# Altium schematic sheet 03-MCU.SchDoc: MCU
size A2; DocumentNumber: 3; SheetNumber: 3; SheetTotal: 15
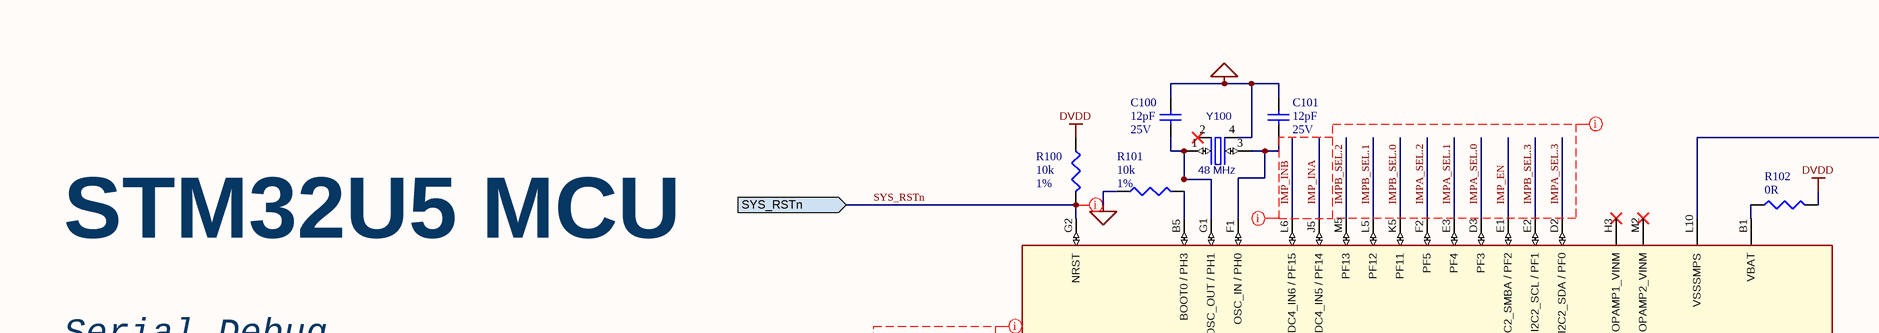
[diagram p0: 03-MCU.SchDoc, top left]
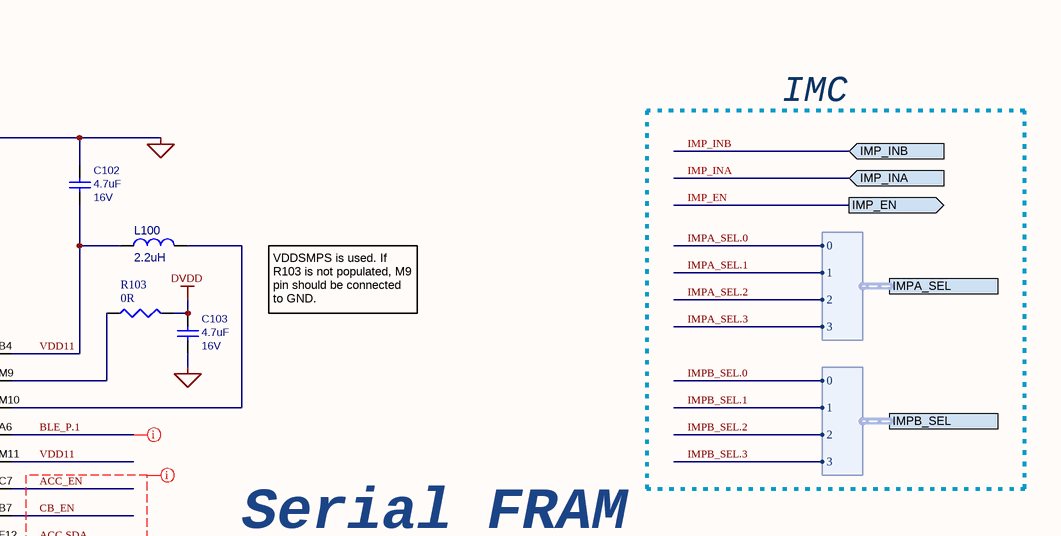
[diagram p1: 03-MCU.SchDoc, top right]
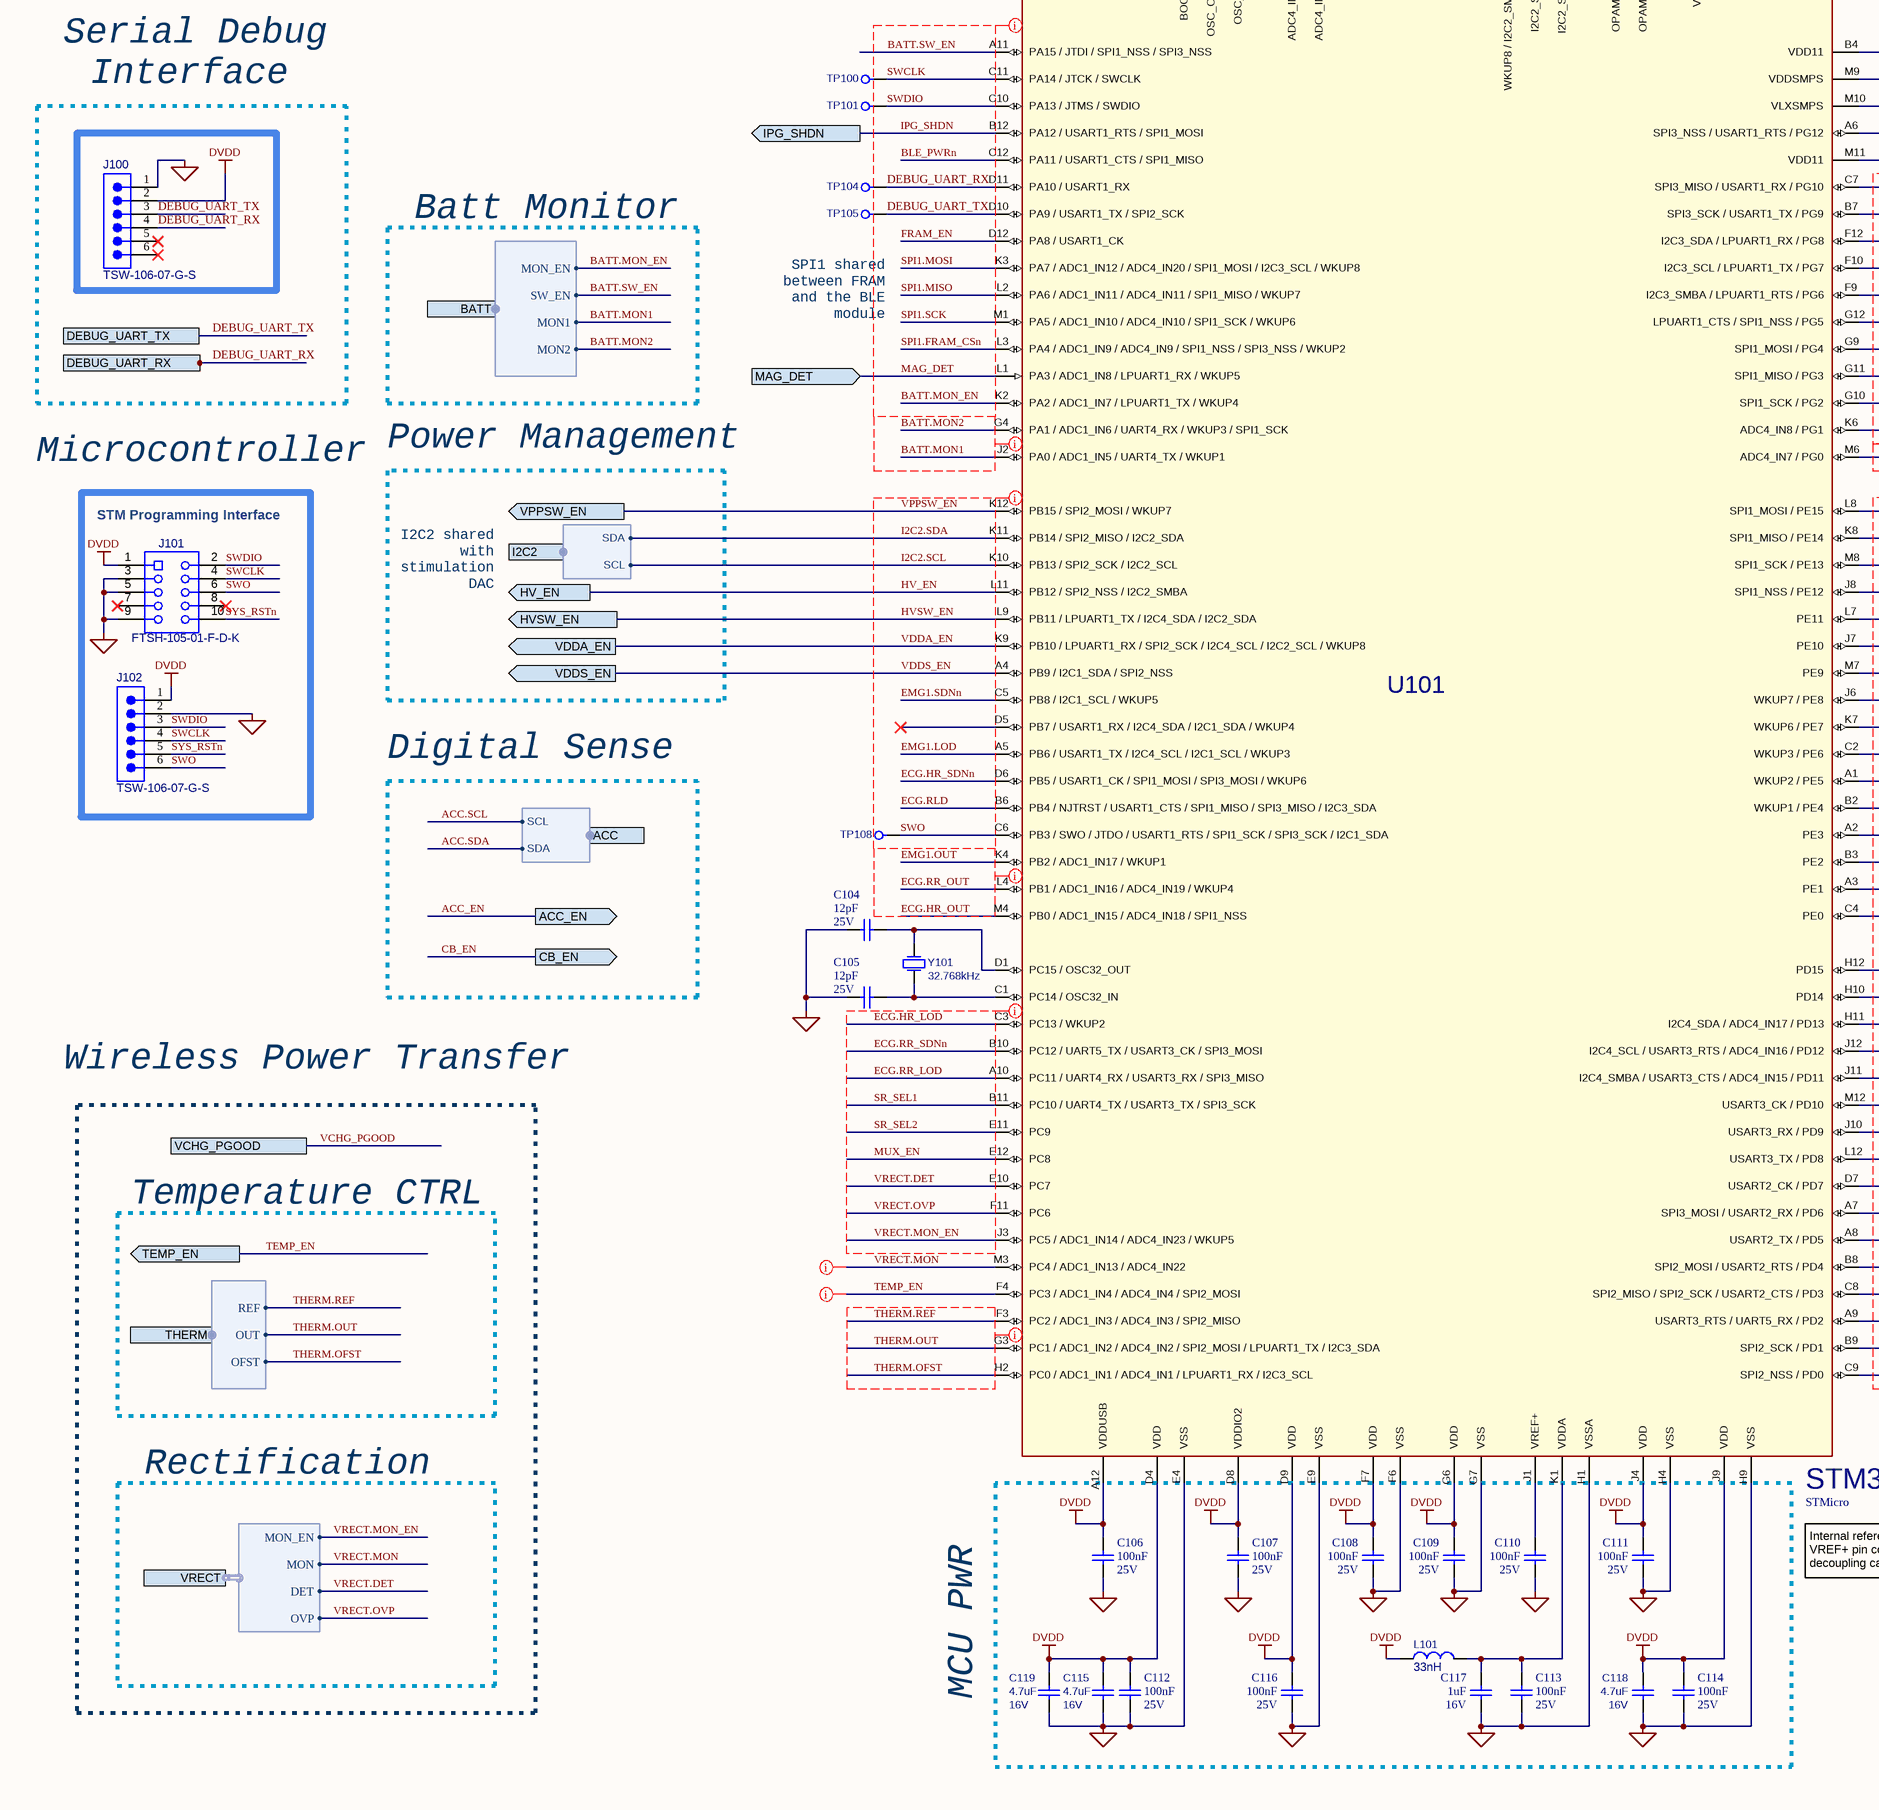
[diagram p2: 03-MCU.SchDoc, bottom left]
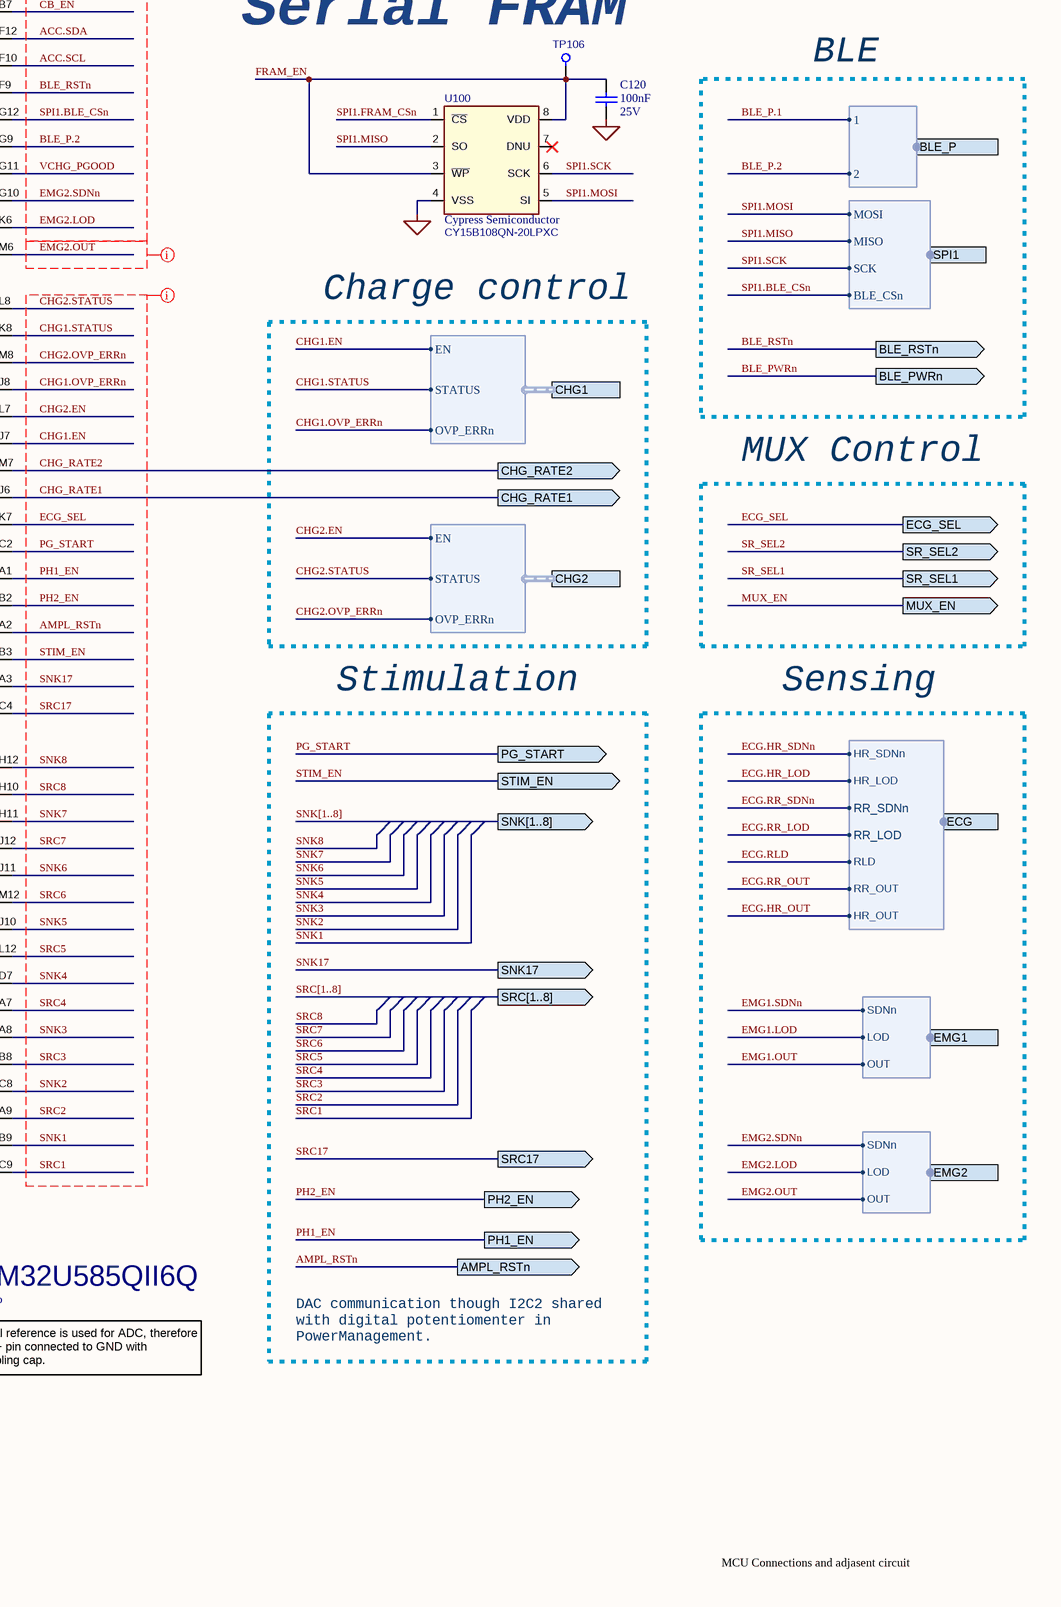
[diagram p3: 03-MCU.SchDoc, bottom right]

## Parts
C100  value 12pF  Rated DC Voltage (URdc): 25V  [C0201_C]  (hidden comment: GRM0335C1E120JA01D)
C101  value 12pF  Rated DC Voltage (URdc): 25V  [C0201_C]  (hidden comment: GRM0335C1E120JA01D)
C102  value 4.7uF  Rating: 16V  [CAP0603_REDUCED]  (hidden comment: GRM188R61C475KE11)
C103  value 4.7uF  Rating: 16V  [CAP0603_REDUCED]  (hidden comment: GRM188R61C475KE11)
C104  value 12pF  Rated DC Voltage (URdc): 25V  [C0201_C]  (hidden comment: GRM0335C1E120JA01D)
C105  value 12pF  Rated DC Voltage (URdc): 25V  [C0201_C]  (hidden comment: GRM0335C1E120JA01D)
C106  value 100nF  Rated DC Voltage (URdc): 25V  [C0201_C]  (hidden comment: GRM033R61E104KE14J)
C107  value 100nF  Rated DC Voltage (URdc): 25V  [C0201_C]  (hidden comment: GRM033R61E104KE14J)
C108  value 100nF  Rated DC Voltage (URdc): 25V  [C0201_C]  (hidden comment: GRM033R61E104KE14J)
C109  value 100nF  Rated DC Voltage (URdc): 25V  [C0201_C]  (hidden comment: GRM033R61E104KE14J)
C110  value 100nF  Rated DC Voltage (URdc): 25V  [C0201_C]  (hidden comment: GRM033R61E104KE14J)
C111  value 100nF  Rated DC Voltage (URdc): 25V  [C0201_C]  (hidden comment: GRM033R61E104KE14J)
C112  value 100nF  Rated DC Voltage (URdc): 25V  [C0201_C]  (hidden comment: GRM033R61E104KE14J)
C113  value 100nF  Rated DC Voltage (URdc): 25V  [C0201_C]  (hidden comment: GRM033R61E104KE14J)
C114  value 100nF  Rated DC Voltage (URdc): 25V  [C0201_C]  (hidden comment: GRM033R61E104KE14J)
C115  value 4.7uF  Rating: 16V  [CAP0603_REDUCED]  (hidden comment: GRM188R61C475KE11)
C116  value 100nF  Rated DC Voltage (URdc): 25V  [C0201_C]  (hidden comment: GRM033R61E104KE14J)
C117  value 1uF  Rated DC Voltage (URdc): 16V  [C0201_C]  (hidden comment: GRM033R61C105ME15D)
C118  value 4.7uF  Rating: 16V  [CAP0603_REDUCED]  (hidden comment: GRM188R61C475KE11)
C119  value 4.7uF  Rating: 16V  [CAP0603_REDUCED]  (hidden comment: GRM188R61C475KE11)
C120  value 100nF  Rated DC Voltage (URdc): 25V  [C0201_C]  (hidden comment: GRM033R61E104KE14J)
J100  TSW-106-07-G-S  [SMTC-TSW-106-07-X-S]
J101  FTSH-105-01-F-D-K  [SAMTEC_FTSH-105-01-XXX-D-K]
J102  TSW-106-07-G-S  [SMTC-TSW-106-07-X-S]
L100  value 2.2uH  [TDK_VLS252010HBX-1]  (hidden comment: VLS252010HBX-2R2M-1)
L101  value 33nH  [L0402_C]  (hidden comment: LQG15HS33NJ02D)
R100  value 10k  Tolerance: 1%  [R0201_C]  (hidden comment: CRCW020110K0FNED)
R101  value 10k  Tolerance: 1%  [R0201_C]  (hidden comment: CRCW020110K0FNED)
R102  value 0R  [R0201_C]  (hidden comment: CRCW02010000Z0ED)
R103  value 0R  [R0201_C]  (hidden comment: CRCW02010000Z0ED)
TP100  Test Point  [testpad_0.9mm]  (value not drawn)  (no BOM)
TP101  Test Point  [testpad_0.9mm]  (value not drawn)  (no BOM)
TP104  Test Point  [testpad_0.9mm]  (value not drawn)  (no BOM)
TP105  Test Point  [testpad_0.9mm]  (value not drawn)  (no BOM)
TP106  Test Point  [testpad_0.9mm]  (value not drawn)  (no BOM)
TP108  Test Point  [testpad_0.9mm]  (value not drawn)  (no BOM)
U100  Manufacturer: Cypress Semiconductor  [CY_002-18131_GQFN8]  (hidden comment: CY15B108QN-20LPXC)
U101  Manufacturer: STMicro  [STM_UFBGA132]  (hidden comment: STM32U585QII6Q)
Y100  value 48 MHz  [XTAL_ECS-SMD-CRYSTAL-10-48-CKY-TR]  (hidden comment: ECS-480-10-48-CKY-TR)
Y101  value 32.768kHz  [MICROCRYSTAL_CC8V-T1A]  (hidden comment: CM8V-T1A-32.768KHZ-6PF-20PPM-TA-QC)

## Blocks framed on the sheet
Interface: J100

## Ports
ACC (harness I2C), ACC_EN (out), AMPL_RSTn (out), BATT (harness BATT), BLE_P (harness BLE PINS), BLE_PWRn (out), BLE_RSTn (out), CB_EN (out), CHG1 (harness CHG_CTRL), CHG2 (harness CHG_CTRL), CHG_RATE1 (out), CHG_RATE2 (out), DEBUG_UART_RX, DEBUG_UART_TX, ECG (harness ECG), ECG_SEL (out), EMG1 (harness EMG), EMG2 (harness EMG), HV_EN (out), HVSW_EN (out), I2C2 (harness I2C), IMP_EN (out), IMP_INA (in), IMP_INB (in), IMPA_SEL (harness MUX_SEL), IMPB_SEL (harness MUX_SEL), IPG_SHDN (out), MAG_DET (in), MUX_EN (out), PG_START (out), PH1_EN (out), PH2_EN (out), SNK17 (out), SNK[1..8] (out), SPI1 (harness BLE_SPI), SR_SEL1 (out), SR_SEL2 (out), SRC17 (out), SRC[1..8] (out), STIM_EN (out), SYS_RSTn (in), TEMP_EN (out), THERM (harness THERMAL CTRL), VCHG_PGOOD, VDDA_EN (out), VDDS_EN (out), VPPSW_EN (out), VRECT (harness VRECT MON)

## Harnesses
MUX_SEL: 0, 1, 2, 3
BLE PINS: 1, 2
BLE_SPI: MOSI, MISO, BLE_CSn, SCK
BATT: MON_EN, SW_EN, MON1, MON2
CHG_CTRL: STATUS, OVP_ERRn, EN
I2C: SDA, SCL
ECG: HR_SDNn, RLD, HR_LOD, HR_OUT, RR_SDNn, RR_LOD, RR_OUT
THERMAL CTRL: REF, OUT, OFST
VRECT MON: OVP, DET, MON, MON_EN
EMG: SDNn, LOD, OUT

## Nets
DVDD: C103.1 C106.2 C107.2 C108.2 C109.2 C111.2 C112.2 C114.2 C115.1 C116.2 C118.1 C119.1 J100.2 J101.1 J102.1 L101.1 R100.1 R102.2 R103.2 U101.A12(VDDUSB) U101.D4(VDD) U101.D8(VDDIO2) U101.D9(VDD) U101.F7(VDD) U101.G6(VDD) U101.J4(VDD) U101.J9(VDD)
GND: C100.1 C101.2 C102.1 C103.2 C104.1 C105.1 C106.1 C107.1 C108.1 C109.1 C110.1 C111.1 C112.1 C113.1 C114.1 C115.2 C116.1 C117.2 C118.2 C119.2 C120.1 J100.1 J101.3 J101.5 J101.9 J102.2 R101.1 U100.4(VSS) U101.E4(VSS) U101.E9(VSS) U101.F6(VSS) U101.G7(VSS) U101.H1(VSSA) U101.H4(VSS) U101.H9(VSS) U101.L10(VSSSMPS) Y100.4(GND)
ACC.SCL: U101.F10(I2C3_SCL_/_LPUART1_TX_/_PG7) ; port ACC.SCL
ACC.SDA: U101.F12(I2C3_SDA_/_LPUART1_RX_/_PG8) ; port ACC.SDA
ACC_EN: U101.C7(SPI3_MISO_/_USART1_RX_/_PG10) ; port ACC_EN
AMPL_RSTn: U101.A2(PE3) ; port AMPL_RSTn
BATT.MON1: U101.J2(PA0_/_ADC1_IN5_/_UART4_TX_/_WKUP1) ; port BATT.MON1
BATT.MON2: U101.G4(PA1_/_ADC1_IN6_/_UART4_RX_/_WKUP3_/_SPI1_SCK) ; port BATT.MON2
BATT.MON_EN: U101.K2(PA2_/_ADC1_IN7_/_LPUART1_TX_/_WKUP4) ; port BATT.MON_EN
BATT.SW_EN: U101.A11(PA15_/_JTDI_/_SPI1_NSS_/_SPI3_NSS) ; port BATT.SW_EN
BLE_P.1: U101.A6(SPI3_NSS_/_USART1_RTS_/_PG12) ; port BLE_P.1
BLE_P.2: U101.G9(SPI1_MOSI_/_PG4) ; port BLE_P.2
BLE_PWRn: U101.C12(PA11_/_USART1_CTS_/_SPI1_MISO) ; port BLE_PWRn
BLE_RSTn: U101.F9(I2C3_SMBA_/_LPUART1_RTS_/_PG6) ; port BLE_RSTn
CB_EN: U101.B7(SPI3_SCK_/_USART1_TX_/_PG9) ; port CB_EN
CHG1.EN: U101.J7(PE10) ; port CHG1.EN
CHG1.OVP_ERRn: U101.J8(SPI1_NSS_/_PE12) ; port CHG1.OVP_ERRn
CHG1.STATUS: U101.K8(SPI1_MISO_/_PE14) ; port CHG1.STATUS
CHG2.EN: U101.L7(PE11) ; port CHG2.EN
CHG2.OVP_ERRn: U101.M8(SPI1_SCK_/_PE13) ; port CHG2.OVP_ERRn
CHG2.STATUS: U101.L8(SPI1_MOSI_/_PE15) ; port CHG2.STATUS
CHG_RATE1: U101.J6(WKUP7_/_PE8) ; port CHG_RATE1
CHG_RATE2: U101.M7(PE9) ; port CHG_RATE2
DEBUG_UART_RX: J100.4 TP104.1 U101.D11(PA10_/_USART1_RX) ; port DEBUG_UART_RX
DEBUG_UART_TX: J100.3 TP105.1 U101.D10(PA9_/_USART1_TX_/_SPI2_SCK) ; port DEBUG_UART_TX
ECG.HR_LOD: U101.C3(PC13_/_WKUP2) ; port ECG.HR_LOD
ECG.HR_OUT: U101.M4(PB0_/_ADC1_IN15_/_ADC4_IN18_/_SPI1_NSS) ; port ECG.HR_OUT
ECG.HR_SDNn: U101.D6(PB5_/_USART1_CK_/_SPI1_MOSI_/_SPI3_MOSI_/_WKUP6) ; port ECG.HR_SDNn
ECG.RLD: U101.B6(PB4_/_NJTRST_/_USART1_CTS_/_SPI1_MISO_/_SPI3_MISO_/_I2C3_SDA) ; port ECG.RLD
ECG.RR_LOD: U101.A10(PC11_/_UART4_RX_/_USART3_RX_/_SPI3_MISO) ; port ECG.RR_LOD
ECG.RR_OUT: U101.L4(PB1_/_ADC1_IN16_/_ADC4_IN19_/_WKUP4) ; port ECG.RR_OUT
ECG.RR_SDNn: U101.B10(PC12_/_UART5_TX_/_USART3_CK_/_SPI3_MOSI) ; port ECG.RR_SDNn
ECG_SEL: U101.K7(WKUP6_/_PE7) ; port ECG_SEL
EMG1.LOD: U101.A5(PB6_/_USART1_TX_/_I2C4_SCL_/_I2C1_SCL_/_WKUP3) ; port EMG1.LOD
EMG1.OUT: U101.K4(PB2_/_ADC1_IN17_/_WKUP1) ; port EMG1.OUT
EMG1.SDNn: U101.C5(PB8_/_I2C1_SCL_/_WKUP5) ; port EMG1.SDNn
EMG2.LOD: U101.K6(ADC4_IN8_/_PG1) ; port EMG2.LOD
EMG2.OUT: U101.M6(ADC4_IN7_/_PG0) ; port EMG2.OUT
EMG2.SDNn: U101.G10(SPI1_SCK_/_PG2) ; port EMG2.SDNn
FRAM_EN: C120.2 TP106.1 U100.3(~{WP}) U100.8(VDD) U101.D12(PA8_/_USART1_CK)
HV_EN: U101.L11(PB12_/_SPI2_NSS_/_I2C2_SMBA) ; port HV_EN
HVSW_EN: U101.L9(PB11_/_LPUART1_TX_/_I2C4_SDA_/_I2C2_SDA) ; port HVSW_EN
I2C2.SCL: U101.K10(PB13_/_SPI2_SCK_/_I2C2_SCL) ; port I2C2.SCL
I2C2.SDA: U101.K11(PB14_/_SPI2_MISO_/_I2C2_SDA) ; port I2C2.SDA
IMP_EN: U101.E1(WKUP8_/_I2C2_SMBA_/_PF2) ; port IMP_EN
IMP_INA: U101.J5(ADC4_IN5_/_PF14) ; port IMP_INA
IMP_INB: U101.L6(ADC4_IN6_/_PF15) ; port IMP_INB
IMPA_SEL.0: U101.D3(PF3) ; port IMPA_SEL.0
IMPA_SEL.1: U101.E3(PF4) ; port IMPA_SEL.1
IMPA_SEL.2: U101.F2(PF5) ; port IMPA_SEL.2
IMPA_SEL.3: U101.D2(I2C2_SDA_/_PF0) ; port IMPA_SEL.3
IMPB_SEL.0: U101.K5(PF11) ; port IMPB_SEL.0
IMPB_SEL.1: U101.L5(PF12) ; port IMPB_SEL.1
IMPB_SEL.2: U101.M5(PF13) ; port IMPB_SEL.2
IMPB_SEL.3: U101.E2(I2C2_SCL_/_PF1) ; port IMPB_SEL.3
IPG_SHDN: U101.B12(PA12_/_USART1_RTS_/_SPI1_MOSI) ; port IPG_SHDN
MAG_DET: U101.L1(PA3_/_ADC1_IN8_/_LPUART1_RX_/_WKUP5) ; port MAG_DET
MUX_EN: U101.E12(PC8) ; port MUX_EN
PG_START: U101.C2(WKUP3_/_PE6) ; port PG_START
PH1_EN: U101.A1(WKUP2_/_PE5) ; port PH1_EN
PH2_EN: U101.B2(WKUP1_/_PE4) ; port PH2_EN
SNK1: U101.B9(SPI2_SCK_/_PD1)
SNK2: U101.C8(SPI2_MISO_/_SPI2_SCK_/_USART2_CTS_/_PD3)
SNK3: U101.A8(USART2_TX_/_PD5)
SNK4: U101.D7(USART2_CK_/_PD7)
SNK5: U101.J10(USART3_RX_/_PD9)
SNK6: U101.J11(I2C4_SMBA_/_USART3_CTS_/_ADC4_IN15_/_PD11)
SNK7: U101.H11(I2C4_SDA_/_ADC4_IN17_/_PD13)
SNK8: U101.H12(PD15)
SNK17: U101.A3(PE1) ; port SNK17
SPI1.BLE_CSn: U101.G12(LPUART1_CTS_/_SPI1_NSS_/_PG5) ; port SPI1.BLE_CSn
SPI1.FRAM_CSn: U100.1(~{CS}) U101.L3(PA4_/_ADC1_IN9_/_ADC4_IN9_/_SPI1_NSS_/_SPI3_NSS_/_WKUP2)
SPI1.MISO: U100.2(SO) U101.L2(PA6_/_ADC1_IN11_/_ADC4_IN11_/_SPI1_MISO_/_WKUP7) ; port SPI1.MISO
SPI1.MOSI: U100.5(SI) U101.K3(PA7_/_ADC1_IN12_/_ADC4_IN20_/_SPI1_MOSI_/_I2C3_SCL_/_WKUP8) ; port SPI1.MOSI
SPI1.SCK: U100.6(SCK) U101.M1(PA5_/_ADC1_IN10_/_ADC4_IN10_/_SPI1_SCK_/_WKUP6) ; port SPI1.SCK
SR_SEL1: U101.B11(PC10_/_UART4_TX_/_USART3_TX_/_SPI3_SCK) ; port SR_SEL1
SR_SEL2: U101.E11(PC9) ; port SR_SEL2
SRC1: U101.C9(SPI2_NSS_/_PD0)
SRC2: U101.A9(USART3_RTS_/_UART5_RX_/_PD2)
SRC3: U101.B8(SPI2_MOSI_/_USART2_RTS_/_PD4)
SRC4: U101.A7(SPI3_MOSI_/_USART2_RX_/_PD6)
SRC5: U101.L12(USART3_TX_/_PD8)
SRC6: U101.M12(USART3_CK_/_PD10)
SRC7: U101.J12(I2C4_SCL_/_USART3_RTS_/_ADC4_IN16_/_PD12)
SRC8: U101.H10(PD14)
SRC17: U101.C4(PE0) ; port SRC17
STIM_EN: U101.B3(PE2) ; port STIM_EN
SWCLK: J101.4 J102.4 TP100.1 U101.C11(PA14_/_JTCK_/_SWCLK)
SWDIO: J101.2 J102.3 TP101.1 U101.C10(PA13_/_JTMS_/_SWDIO)
SWO: J101.6 J102.6 TP108.1 U101.C6(PB3_/_SWO_/_JTDO_/_USART1_RTS_/_SPI1_SCK_/_SPI3_SCK_/_I2C1_SDA)
SYS_RSTn: J101.10 J102.5 R100.2 U101.G2(NRST) ; port SYS_RSTn
TEMP_EN: U101.F4(PC3_/_ADC1_IN4_/_ADC4_IN4_/_SPI2_MOSI) ; port TEMP_EN
THERM.OFST: U101.H2(PC0_/_ADC1_IN1_/_ADC4_IN1_/_LPUART1_RX_/_I2C3_SCL) ; port THERM.OFST
THERM.OUT: U101.G3(PC1_/_ADC1_IN2_/_ADC4_IN2_/_SPI2_MOSI_/_LPUART1_TX_/_I2C3_SDA) ; port THERM.OUT
THERM.REF: U101.F3(PC2_/_ADC1_IN3_/_ADC4_IN3_/_SPI2_MISO) ; port THERM.REF
VCHG_PGOOD: U101.G11(SPI1_MISO_/_PG3) ; port VCHG_PGOOD
VDD11: C102.2 L100.1 U101.B4(VDD11) U101.M11(VDD11)
VDDA_EN: U101.K9(PB10_/_LPUART1_RX_/_SPI2_SCK_/_I2C4_SCL_/_I2C2_SCL_/_WKUP8) ; port VDDA_EN
VDDS_EN: U101.A4(PB9_/_I2C1_SDA_/_SPI2_NSS) ; port VDDS_EN
VPPSW_EN: U101.K12(PB15_/_SPI2_MOSI_/_WKUP7) ; port VPPSW_EN
VRECT.DET: U101.E10(PC7) ; port VRECT.DET
VRECT.MON: U101.M3(PC4_/_ADC1_IN13_/_ADC4_IN22) ; port VRECT.MON
VRECT.MON_EN: U101.J3(PC5_/_ADC1_IN14_/_ADC4_IN23_/_WKUP5) ; port VRECT.MON_EN
VRECT.OVP: U101.F11(PC6) ; port VRECT.OVP
NetC100_2: C100.2 U101.G1(OSC_OUT_/_PH1) Y100.1(IN/OUT)
NetC101_1: C101.1 U101.F1(OSC_IN_/_PH0) Y100.3(OUT/IN)
NetC104_2: C104.2 U101.D1(PC15_/_OSC32_OUT) Y101.2
NetC105_2: C105.2 U101.C1(PC14_/_OSC32_IN) Y101.1
NetC110_2: C110.2 U101.J1(VREF+)
NetC113_2: C113.2 C117.1 L101.2 U101.K1(VDDA)
NetL100_2: L100.2 U101.M10(VLXSMPS)
NetR101_2: R101.2 U101.B5(BOOT0_/_PH3)
NetR102_1: R102.1 U101.B1(VBAT)
NetR103_1: R103.1 U101.M9(VDDSMPS)

Not connected (* = marked no-connect by the designer): J100 5* 6*; J101 7* 8*; U100 7(DNU)*; U101 D5(PB7_/_USART1_RX_/_I2C4_SDA_/_I2C1_SDA_/_WKUP4)* H3(OPAMP1_VINM)* M2(OPAMP2_VINM)*; Y100 2(NC)*

## Buses and harness runs
bus SNK[1..8] = port SNK[1..8]
bus SRC[1..8] = port SRC[1..8]

## Layout directives
net class DIGITAL: ACC.SCL, ACC.SDA, ACC_EN, AMPL_RSTn, BATT.MON_EN, BATT.SW_EN, BLE_P.1, BLE_P.2, BLE_PWRn, BLE_RSTn, CB_EN, CHG1.EN, CHG1.OVP_ERRn, CHG1.STATUS, CHG2.EN, CHG2.OVP_ERRn, CHG2.STATUS, CHG_RATE1, CHG_RATE2, DEBUG_UART_RX, DEBUG_UART_TX, ECG.HR_LOD, ECG.HR_SDNn, ECG.RLD, ECG.RR_LOD, ECG.RR_SDNn, ECG_SEL, EMG1.LOD, EMG1.SDNn, EMG2.LOD, EMG2.SDNn, FRAM_EN, HV_EN, HVSW_EN, I2C2.SCL, I2C2.SDA, IMP_EN, IMPA_SEL.0, IMPA_SEL.1, IMPA_SEL.2, IMPA_SEL.3, IMPB_SEL.0, IMPB_SEL.1, IMPB_SEL.2, IMPB_SEL.3, IPG_SHDN, MAG_DET, MUX_EN, PG_START, PH1_EN, PH2_EN, SNK1, SNK2, SNK3, SNK4, SNK5, SNK6, SNK7, SNK8, SNK17, SPI1.BLE_CSn, SPI1.FRAM_CSn, SPI1.MISO, SPI1.MOSI, SPI1.SCK, SR_SEL1, SR_SEL2, SRC1, SRC2, SRC3, SRC4, SRC5, SRC6, SRC7, SRC8, SRC17, STIM_EN, SWCLK, SWDIO, SWO, SYS_RSTn, TEMP_EN, VCHG_PGOOD, VDDA_EN, VDDS_EN, VPPSW_EN, VRECT.DET, VRECT.MON_EN, VRECT.OVP
net class ANALOG: BATT.MON1, BATT.MON2, ECG.HR_OUT, ECG.RR_OUT, EMG1.OUT, EMG2.OUT, IMP_INA, IMP_INB, THERM.OFST, THERM.OUT, THERM.REF, VRECT.MON

## Notes on the sheet
- IMC
- STM32U5 MCU
- VDDSMPS is used. If R103 is not populated, M9 pin should be connected to GND.
- Serial Debug
- Batt Monitor
- (near TP106) Serial FRAM
- BLE
- (near TP105) SPI1 shared between FRAM and the BLE module
- Microcontroller
- Power Management
- (near J101) STM Programming Interface
- Charge control
- I2C2 shared with stimulation DAC
- MUX Control
- Digital Sense
- Stimulation
- Sensing
- Wireless Power Transfer
- Temperature CTRL
- Rectification
- Internal reference is used for ADC, therefore VREF+ pin connected to GND with decoupling cap.
- DAC communication though I2C2 shared with digital potentiomenter in PowerManagement.
- MCU PWR
- MCU Connections and adjasent circuit
- Project:
- Schematic:
- Design by:
- Date:
- Ver:
- .
- Comments:
- Reviewed by:

## Library data of the parts
C100 C101 C104 C105 = GRM0335C1E120JA01D: Ceramic Capacitor, Multilayer, Ceramic, 25V, 5% +Tol, 5% -Tol, C0G, 30ppm/Cel TC, 0.000012uF, Surface Mount, 0201; Manufacturer: Murata; Multilayer: Yes; Category: Ceramic Capacitors; Supplier: Digikey; Supplier Part Number: 490-3144-1-ND; Manufacturer Part Number: GRM0335C1E120JA01D; RoHS: Yes; Stock: 4384132; Pricing: 1=0,1, 10=0,011, 50=0,0062, 100=0,0048, 500=0,0036, 1000=0,00283, 2500=0,00258, 5000=0,00237 (USD); Mounting Technology: Surface Mount; Pins: 2; Dielectric Material: Ceramic; Package Shape: Rectangular; Case/Package: 0201; Terminal Finish: Nickel; Min Operating Temperature: -55°C; Max Operating Temperature: 125°C; Termination: Wraparound; JESD-609 Code: e3; Capacitor Type: Ceramic; Tolerance  (fill in as +-): 5%; Packaging: Tape and Reel; Tolerance (fill in as +-): 5%; Temperature Characteristics Code: C0G; Reach SVHC Compliant: Yes; RoHS Compliant: Yes; ComponentLink1URL: https://datasheet.ciiva.com:443/pdfs/VipMasterIC/IC/MURE/MURE-S-A0004347008/MURE-S-A0004348737-1.pdf?src-supplier=IHS+Markit; ComponentLink1Description: https://datasheet.ciiva.com:443/pdfs/VipMasterIC/IC/MURE/MURE-S-A0004347008/MURE-S-A0004348737-1.pdf?src-supplier=IHS+Markit; Supplier 1: Arrow Electronics; Supplier Part Number 1: GRM0335C1E120JA01D
C102 C103 C115 C118 C119 = GRM188R61C475KE11: Capacitor, 4.7uF, X5R, 16V, 10%, 0603, Implant-grade; Manufacturer: Murata; Medical Grade MFR PN: GCH188R61C475KE11; Length (mm): 1.60 ±0.10; Medical Grade MFR: Murata; PCB Footprint: cap0603_reduced; Thickness (mm): 0.80 ±0.10; Width (mm): 0.80 ±0.10; Category: Capacitor; Package Description: 0603; Check: *; Supplier 1: Arrow Electronics; Supplier Part Number 1: GRM188R61C475KE11D; Status: *; Review: *; Manufacturer Part Number: GRM188R61C475KE11
C106-C114 C116 C120 = GRM033R61E104KE14J: Ceramic Capacitor, Multilayer, Ceramic, 25V, 10% +Tol, 10% -Tol, X5R, 15% TC, 0.1uF, Surface Mount, 0201; Manufacturer: Murata; Multilayer: Yes; Category: Ceramic Capacitors; Supplier: Digikey; Supplier Part Number: 490-14571-1-ND; Manufacturer Part Number: GRM033R61E104KE14J; RoHS: Yes; Stock: 1540851; Pricing: 1=0,1, 10=0,033, 50=0,0192, 100=0,0148, 500=0,01118, 1000=0,00878, 2500=0,00798, 5000=0,00734 (USD); Mounting Technology: Surface Mount; Pins: 2; Dielectric Material: Ceramic; Package Shape: Rectangular; Case/Package: 0201; Terminal Finish: Nickel; Min Operating Temperature: -55°C; Max Operating Temperature: 85°C; JESD-609 Code: e3; Capacitor Type: Ceramic; Tolerance  (fill in as +-): 10%; Package Style: SMTMeter; Packaging: Tape and Reel; Tolerance (fill in as +-): 10%; Temperature Characteristics Code: X5R; Termination: Wraparound; Length: 0.6mm; Width: 0.3mm; Height: 0.3mm; Reach SVHC Compliant: Yes; RoHS Compliant: Yes; ComponentLink1URL: https://psearch.en.murata.com:443/capacitor/product/GRM033R61E104KE14%23.pdf?src-supplier=IHS+Markit; ComponentLink1Description: https://psearch.en.murata.com:443/capacitor/product/GRM033R61E104KE14%23.pdf?src-supplier=IHS+Markit; ComponentLink2URL: http://www.mouser.com/ds/2/281/c02e-2905.pdf?src-supplier=Mouser; ComponentLink2Description: http://www.mouser.com/ds/2/281/c02e-2905.pdf?src-supplier=Mouser; ComponentLink3URL: http://search.murata.co.jp/Ceramy/image/img/A01X/G101/ENG/GRM033R61E104KE14-01.pdf?src-supplier=Digikey; ComponentLink3Description: http://search.murata.co.jp/Ceramy/image/img/A01X/G101/ENG/GRM033R61E104KE14-01.pdf?src-supplier=Digikey; ComponentLink4URL: https://search.murata.co.jp/Ceramy/image/img/A01X/G101/ENG/GRM033R61E104KE14-01.pdf?src-supplier=Digikey; ComponentLink4Description: https://search.murata.co.jp/Ceramy/image/img/A01X/G101/ENG/GRM033R61E104KE14-01.pdf?src-supplier=Digikey; Supplier 1: Arrow Electronics; Supplier Part Number 1: GRM033R61E104KE14J
C117 = GRM033R61C105ME15D: Ceramic Capacitor, Multilayer, Ceramic, 16V, 20% +Tol, 20% -Tol, X5R, 15% TC, 1uF, Surface Mount, 0201; Manufacturer: Murata; Category: Ceramic Capacitors; Supplier: Digikey; Supplier Part Number: 490-18654-1-ND; Manufacturer Part Number: GRM033R61C105ME15D; RoHS: No; Stock: 132893; Pricing: 1=0,16, 10=0,105, 50=0,0628, 100=0,0493, 500=0,03644, 1000=0,03017, 2500=0,02808, 5000=0,02569 (USD); Supplier 1: Avnet; Supplier Part Number 1: GRM033R61C105ME15D
J100 J102 = TSW-106-07-G-S: 0.025" SQ Post Header, Through-hole, Vertical, -55 to 125 degC, 2.54 mm Pitch, 6-Pin, Male, RoHS; Manufacturer: Samtec; Pitch: 2.54 mm; Connector Type: BOARD CONNECTOR; Number of Rows Loaded: 1; Number of Contacts: 6; Option: General Purpose; Filter Feature: No; Additional Feature: E.L.P.; Body/Shell Style: RECEPTACLE; Contact Pattern: RECTANGULAR; Contact Style: SQ PIN-SKT; Mating Information: MULTIPLE MATING PARTS AVAILABLE; Body Breadth: 0.1inch; Plating Thickness: 10uin; Reference Standard: UL; Reliability: COMMERCIAL; RoHS: True; ComponentLink1Description: Manufacturer URL; DatasheetVersion: F-214; Orientation: Vertical; ComponentLink1URL: http://www.samtec.com; ComponentLink3Description: Package Specification; ComponentLink2Description: Datasheet; PackageVersion: DM, 8/1988; PackageDescription: .025[0.64] SQ. Post Terminal Strip Assembly; PackageReference: TSW-106-07-X-S; Mounting Technology: Through-hole; Temperature Range: -55 to 125 degC; ComponentLink3URL: http://www.samtec.com/documents/webfiles/cpdf/TSW-XXX-XX-XXX-X-XX-XXX-MKT.pdf; ComponentLink2URL: http://www.samtec.com/documents/webfiles/pdf/TSW_TH.PDF; PartNumber: TSW-106-07-G-S; Supplier: Arrow Electronics; Supplier Part Number: TSW-106-07-G-S; Manufacturer Part Number: TSW-106-07-G-S; Category: Connectors; Stock: 414060; Pricing: 1=0,89, 50=0,69, 100=0,56, 500=0,47, 1000=0,35, 2000=0,31, 5000=0,23 (USD); Contact Finish - Mating: GOLD (10) OVER NICKEL (50); Contact Finish - Termination: Gold (Au) - with Nickel (Ni) barrier; Contact Material: Bronze; Insulation Color: Black; Insulation Material: Glass; JESD-609 Code: e4; Contact Gender: Male; Mounting Style: STRAIGHT; Termination: Solder; Mixed Contacts: No; Number Of Connectors: 1; Number Of PCB Rows: 1; PCB Contact Pattern: RECTANGULAR; Terminal Pitch: 2.54mm; Body Depth: 0.1inch; Mating Contact Pitch: 0.1inch; Terminal Length: 0.1inch; Reach SVHC Compliant: Yes; RoHS Compliant: Yes; DIN Conformance: No; IEC Conformance: No; MIL Conformance: No; ComponentLink4URL: https://datasheet.ciiva.com:443/pdfs/VipMasterIC/IC/SAMI/SAMI-S-A0002522030/SAMI-S-A0002522030-1.pdf?src-supplier=IHS+Markit; ComponentLink4Description: https://datasheet.ciiva.com:443/pdfs/VipMasterIC/IC/SAMI/SAMI-S-A0002522030/SAMI-S-A0002522030-1.pdf?src-supplier=IHS+Markit; ComponentLink5URL: https://datasheet.ciiva.com/6888/tsw-xxx-xx-xxx-x-xx-xxx-mkt-6888455.pdf?src-supplier=Digi-Key; ComponentLink5Description: https://datasheet.ciiva.com/6888/tsw-xxx-xx-xxx-x-xx-xxx-mkt-6888455.pdf?src-supplier=Digi-Key; ComponentLink6URL: https://datasheet.ciiva.com/9486/htsw-th-9486442.pdf?src-supplier=Avnet; ComponentLink6Description: https://datasheet.ciiva.com/9486/htsw-th-9486442.pdf?src-supplier=Avnet; Supplier 1: Arrow Electronics; Supplier Part Number 1: TSW-106-07-G-S
J101 = FTSH-105-01-F-D-K: Connector, 1.27 mm, 2x5, Male, TH; Manufacturer: Samtec; Review: 020823; Value: FTSH-105-01-F-D-K; Supplier 1: Mouser; Supplier Part Number 1: 200-FTSH10501FDK; Status: Approved; Manufacturer Part Number: FTSH-105-01-F-D-K
L100 = VLS252010HBX-2R2M-1: Inductor, 2.2uH, 1.76A, 1008; Manufacturer: TDK; Review: 020823; Category: Inductor; Rating: 1.76A; Supplier 1: Arrow Electronics; Supplier Part Number 1: VLS252010HBX-2R2M-1; Status: Approved; Manufacturer Part Number: VLS252010HBX-2R2M-1
L101 = LQG15HS33NJ02D: Inductor, Unshielded, 33nH, 350mA, 0402; Manufacturer: Murata; Medical Grade MFR: TBD; Review: 020823; Category: Inductor; Length (mm): TBD; Medical Grade MFR PN: TBD; Thickness (mm): TBD; Width (mm): TBD; PCB Footprint: TBD; Supplier 1: Arrow Electronics; Supplier Part Number 1: LQG15HS33NJ02D; Status: Approved; Manufacturer Part Number: LQG15HS33NJ02D
R100 R101 = CRCW020110K0FNED: Fixed Resistor, Metal Glaze/thick Film, 0.05W, 10000ohm, 30V, 1% +/-Tol, 200ppm/Cel, Surface Mount, 0201; Manufacturer: Vishay; Medical Grade MFR: Mini-Systems; Medical Grade MFR PN: MWA96SM-1002F-NS62TR; Power: 50mW; Rated Temperature: 70°C; Temperature Coefficient: 200ppm/°C; Package Height: 0.23mm; Package Length: 0.6mm; Package Width: 0.3mm; Reference Standard: AEC-Q200; Category: Chip SMD Resistors; Supplier: Digikey; Supplier Part Number: 541-10.0KABCT-ND; Manufacturer Part Number: CRCW020110K0FNED; RoHS: Yes; Stock: 1011530; Pricing: 1=0,1, 10=0,037, 50=0,0242, 100=0,0204, 500=0,01426, 1000=0,01241, 5000=0,00924 (USD); Mounting Technology: Surface Mount; Pins: 2; Package Shape: Rectangular; Case/Package: 0201; Terminal Finish: Nickel; Min Operating Temperature: -55°C; Max Operating Temperature: 155°C; JESD-609 Code: e3; Resistor Type: FIXED RESISTOR; Construction: Chip; Package Style: SMTMeter; Packaging: Tape and Reel; Technology: METAL GLAZE/THICK FILM; Termination: Wraparound; Working Voltage: 30V; Reach SVHC Compliant: Yes; RoHS Compliant: Yes; ComponentLink1URL: https://datasheet.ciiva.com:443/pdfs/VipMasterIC/IC/VISH/VISH-S-A0002932828/VISH-S-A0002932828-1.pdf?src-supplier=IHS+Markit; ComponentLink1Description: https://datasheet.ciiva.com:443/pdfs/VipMasterIC/IC/VISH/VISH-S-A0002932828/VISH-S-A0002932828-1.pdf?src-supplier=IHS+Markit; ComponentLink2URL: https://datasheet.ciiva.com/2474/crcw0201e3-2474819.pdf?src-supplier=Digikey; ComponentLink2Description: https://datasheet.ciiva.com/2474/crcw0201e3-2474819.pdf?src-supplier=Digikey; ComponentLink3URL: https://datasheet.ciiva.com/2474/crcw0201e3-2474820.pdf?src-supplier=Digikey; ComponentLink3Description: https://datasheet.ciiva.com/2474/crcw0201e3-2474820.pdf?src-supplier=Digikey; ComponentLink4URL: https://datasheet.ciiva.com/2474/crcw0201e3-2474818.pdf?src-supplier=Digikey; ComponentLink4Description: https://datasheet.ciiva.com/2474/crcw0201e3-2474818.pdf?src-supplier=Digikey; ComponentLink5URL: https://datasheet.ciiva.com/16436/dcrcwe3-16436222.pdf?src-supplier=Future+Electronics; ComponentLink5Description: https://datasheet.ciiva.com/16436/dcrcwe3-16436222.pdf?src-supplier=Future+Electronics; ComponentLink6URL: https://datasheet.ciiva.com/7983/1719906-7983320.pdf?src-supplier=Element14; ComponentLink6Description: https://datasheet.ciiva.com/7983/1719906-7983320.pdf?src-supplier=Element14; ComponentLink7URL: https://datasheet.ciiva.com/7983/1719906-7983319.pdf?src-supplier=Element14; ComponentLink7Description: https://datasheet.ciiva.com/7983/1719906-7983319.pdf?src-supplier=Element14; ComponentLink8URL: https://datasheet.ciiva.com/22692/1719906-22692709.pdf?src-supplier=Element14; ComponentLink8Description: https://datasheet.ciiva.com/22692/1719906-22692709.pdf?src-supplier=Element14; Supplier 1: Mouser; Supplier Part Number 1: 71-CRCW0201-10K
R102 R103 = CRCW02010000Z0ED: Fixed Resistor, Metal Glaze/thick Film, 0.05W, 0ohm, Surface Mount, 0201; Manufacturer: Vishay; Medical Grade MFR: Mini-Systems; Medical Grade MFR PN: MWA96SM-0000F-NS62TR; Power: 50mW; Rated Temperature: 70°C; Package Height: 0.23mm; Package Length: 0.6mm; Package Width: 0.3mm; Reference Standard: AEC-Q200; Category: Chip SMD Resistors; Supplier: Digikey; Supplier Part Number: 541-0.0AGCT-ND; Manufacturer Part Number: CRCW02010000Z0ED; RoHS: Yes; Stock: 701366; Pricing: 1=0,1, 10=0,034, 25=0,026, 50=0,0198, 100=0,0138, 250=0,01112, 500=0,0089, 1000=0,00655, 5000=0,0047 (USD); Mounting Technology: Surface Mount; Pins: 2; Package Shape: Rectangular; Case/Package: 0201; Terminal Finish: Nickel; Min Operating Temperature: -55°C; Max Operating Temperature: 155°C; JESD-609 Code: e3; Resistor Type: FIXED RESISTOR; Construction: Chip; Package Style: SMTMeter; Packaging: Tape and Reel; Technology: METAL GLAZE/THICK FILM; Termination: Wraparound; Reach SVHC Compliant: Yes; RoHS Compliant: Yes; ComponentLink1URL: https://datasheet.ciiva.com:443/pdfs/VipMasterIC/IC/VISH/VISH-S-A0002932828/VISH-S-A0002932828-1.pdf?src-supplier=IHS+Markit; ComponentLink1Description: https://datasheet.ciiva.com:443/pdfs/VipMasterIC/IC/VISH/VISH-S-A0002932828/VISH-S-A0002932828-1.pdf?src-supplier=IHS+Markit; ComponentLink2URL: https://datasheet.ciiva.com/2471/crcw0201e3-2471712.pdf?src-supplier=Digikey; ComponentLink2Description: https://datasheet.ciiva.com/2471/crcw0201e3-2471712.pdf?src-supplier=Digikey; ComponentLink3URL: https://datasheet.ciiva.com/7841/1719906-7841431.pdf?src-supplier=Element14; ComponentLink3Description: https://datasheet.ciiva.com/7841/1719906-7841431.pdf?src-supplier=Element14; ComponentLink4URL: https://datasheet.ciiva.com/7841/1719906-7841430.pdf?src-supplier=Element14; ComponentLink4Description: https://datasheet.ciiva.com/7841/1719906-7841430.pdf?src-supplier=Element14; ComponentLink5URL: https://datasheet.ciiva.com/22665/1847332-22665688.pdf?src-supplier=Element14; ComponentLink5Description: https://datasheet.ciiva.com/22665/1847332-22665688.pdf?src-supplier=Element14; ComponentLink6URL: https://datasheet.ciiva.com/2471/crcw0201e3-2471713.pdf?src-supplier=Digikey; ComponentLink6Description: https://datasheet.ciiva.com/2471/crcw0201e3-2471713.pdf?src-supplier=Digikey; ComponentLink7URL: https://datasheet.ciiva.com/2471/crcw0201e3-2471711.pdf?src-supplier=Digikey; ComponentLink7Description: https://datasheet.ciiva.com/2471/crcw0201e3-2471711.pdf?src-supplier=Digikey; ComponentLink8URL: https://datasheet.ciiva.com/16757/70202042-16757849.pdf?src-supplier=Allied+Electronics; ComponentLink8Description: https://datasheet.ciiva.com/16757/70202042-16757849.pdf?src-supplier=Allied+Electronics; ComponentLink9URL: https://datasheet.ciiva.com/16436/crcw0201e3-16436237.pdf?src-supplier=Future+Electronics; ComponentLink9Description: https://datasheet.ciiva.com/16436/crcw0201e3-16436237.pdf?src-supplier=Future+Electronics; Supplier 1: Digikey; Supplier Part Number 1: 541-0.0AGDKR-ND
TP100 TP101 TP104-TP106 TP108 = Test Point: Test pad, 0.90mm circular pad; PCB Footprint: testpad_0p90mm; Length (mm): 0.90; Manufacturer: N/A; Manufacturer PN: N/A; Medical Grade MFR: N/A; Medical Grade MFR PN: N/A; Rating: N/A; Thickness (mm): N/A; Value: Test point; Width (mm): 0.90; Category: Test point; Status: *; Review: *
U100 = CY15B108QN-20LPXC: FRAM, 8 Mbit (1024k x 8), SPI, 1.8-3.6V, QFN-8; Medical Grade MFR: TBD; Rating: 3.6V; Category: IC; Length (mm): 3.28 ±0.05; Medical Grade MFR PN: TBD; PCB Footprint: TBD; Thickness (mm): 0.50 ±0.05; Value: CY15B108QN-20LPXC; Width (mm): 3.23 ±0.05; Package Description: TBD; Supplier 1: Heisener; Supplier Part Number 1: CY15B108QN-20LPXC; Status: *; Review: *; Manufacturer Part Number: CY15B108QN-20LPXC
U101 = STM32U585QII6Q: Microcontroller, ARM Cortex-M33, 2.0 MB Flash, 786 kB RAM, BGA-132 pins with dedicated pinout supporting SMPS step-down converter; Medical Grade MFR: TBD; Category: IC; Length (mm): 7.00 ±0.15; Medical Grade MFR PN: TBD; Package Description: TBD; PCB Footprint: TBD; Rating: TBD; Thickness (mm): 0.60; Width (mm): 7.00 ±0.15; Supplier 1: Mouser; Supplier Part Number 1: 511-STM32U585QII6Q; Status: *; Review: *; Value: STM32U585QII6Q; Manufacturer Part Number: STM32U585QII6Q
Y100 = ECS-480-10-48-CKY-TR: 48 MHz Â±10ppm Crystal 10pF 100 Ohms 4-SMD, No Lead; Manufacturer: ECS Inc.; Medical Grade MFR: TBD; Category: Crystal; Length (mm): 1.20; Medical Grade MFR PN: TBD; PCB Footprint: TBD; Rating: N/A; Thickness (mm): 0.33; Width (mm): 1.00; Package Description: 4-SMD, No Lead; Supplier 1: Digi-Key; Supplier Part Number 1: XC3037CT-ND; Status: *; Review: *; Manufacturer Part Number: ECS-480-10-48-CKY-TR
Y101 = CM8V-T1A-32.768KHZ-6PF-20PPM-TA-QC: CRYSTAL 32.7680KHZ 6PF SMD; Manufacturer: Micro Crystal; Medical Grade MFR PN: CC8V-T1A32.768kHz6.0pF±20ppmTAQM; PCB Footprint: TBD; Review: 020823; Category: Crystal; Length (mm): 2.00; Medical Grade MFR: Micro Crystal; Rating: N/A; Thickness (mm): 0.67; Width (mm): 1.20; Package Description: CC8V; Supplier 1: Digi-Key; Supplier Part Number 1: 2195-CM8V-T1A-32.768KHZ-6PF-20PPM-TA-QCCT-ND; Status: Approved; Manufacturer Part Number: CM8V-T1A-32.768KHZ-6PF-20PPM-TA-QC